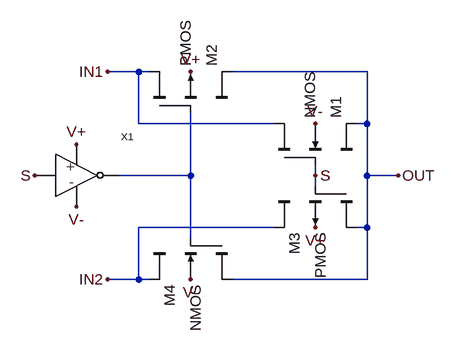
[diagram p0: schematic SPDT_1.asc]
SPDT_1.asc, the LTspice schematic file:
Version 4
SHEET 1 880 680
WIRE -16 160 -64 160
WIRE 0 160 -16 160
WIRE 336 160 128 160
WIRE -16 240 -16 160
WIRE 192 240 -16 240
WIRE 336 240 336 160
WIRE 336 240 320 240
WIRE 64 320 64 224
WIRE 64 320 -48 320
WIRE 256 320 256 304
WIRE 336 320 336 240
WIRE 384 320 336 320
WIRE 256 336 256 320
WIRE 192 400 -16 400
WIRE 336 400 336 320
WIRE 336 400 320 400
WIRE 64 416 64 320
WIRE -16 480 -16 400
WIRE -16 480 -64 480
WIRE 0 480 -16 480
WIRE 336 480 336 400
WIRE 336 480 128 480
FLAG 256 240 V-
FLAG 64 160 V+
FLAG 256 400 V+
FLAG 64 480 V-
FLAG 256 320 S
FLAG -64 160 IN1
FLAG -64 480 IN2
FLAG 384 320 OUT
FLAG -112 368 V-
FLAG -112 272 V+
FLAG -176 320 S
SYMBOL cktsym\\nmos4 256 240 M270
SYMATTR InstName M1
SYMATTR Value2 l=nmosL w=nmosW
SYMBOL cktsym\\pmos4 64 160 M270
SYMATTR InstName M2
SYMATTR Value2 l=pmosL w=pmosW
SYMBOL cktsym\\pmos4 256 400 M90
SYMATTR InstName M3
SYMATTR Value2 l=pmosL w=pmosW
SYMBOL cktsym\\nmos4 64 480 M90
SYMATTR InstName M4
SYMATTR Value2 l=nmosL w=nmosW
SYMBOL Inverter -112 320 R0
SYMATTR InstName X1
SYMATTR SpiceLine nmosL=nmosL nmosW=nmosW pmosL=pmosL pmosW=pmosW

The netlist it stands for:
* SPDT_1.asc
M1 OUT S IN1 V- NMOS l=nmosL w=nmosW
M2 IN1 N001 OUT V+ PMOS l=pmosL w=pmosW
M3 OUT S IN2 V+ PMOS l=pmosL w=pmosW
M4 IN2 N001 OUT V- NMOS l=nmosL w=nmosW
XX1 S N001 V+ V- Inverter nmosL=nmosL nmosW=nmosW pmosL=pmosL pmosW=pmosW  ; pins IN OUT pos neg
.model NMOS NMOS
.model PMOS PMOS
.lib standard.mos
.backanno
.end